# Altium schematic sheet UART EC25 .SchDoc
size A; SheetNumber: 1; SheetTotal: 9
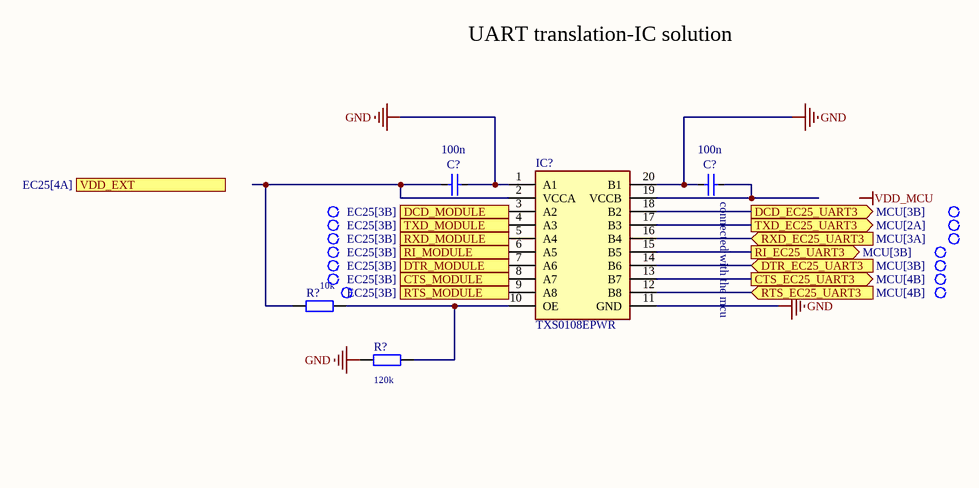
[diagram p0: UART EC25 .SchDoc]

## Parts
(Parts that share a designator on the sheet are numbered #1, #2 ... from top to bottom, then left to right.)
C?#1  value 100n  [CAPC1005X06N]  (hidden comment: C)
C?#2  value 100n  [CAPC1005X06N]  (hidden comment: C)
IC?  TXS0108EPWR  [SOP65P640X120-20N]
R?#1  value 10k  [RESC1005X04N]  (hidden comment: R)
R?#2  value 120k  [RESC1005X04N]  (hidden comment: R)

## Ports
CTS_EC25_UART3 (out, see MCU[4B]), CTS_MODULE (in, see EC25[3B]), DCD_EC25_UART3 (out, see MCU[3B]), DCD_MODULE (in, see EC25[3B]), DTR_EC25_UART3 (in, see MCU[3B]), DTR_MODULE (out, see EC25[3B]), RI_EC25_UART3 (out, see MCU[3B]), RI_MODULE (in, see EC25[3B]), RTS_EC25_UART3 (in, see MCU[4B]), RTS_MODULE (out, see EC25[3B]), RXD_EC25_UART3 (in, see MCU[3A]), RXD_MODULE (out, see EC25[3B]), TXD_EC25_UART3 (out, see MCU[2A]), TXD_MODULE (in, see EC25[3B]), VDD_EXT (in, see EC25[4A])

## Nets
GND: C?#1.2 C?#2.1 IC?.1(A1) IC?.11(GND) IC?.20(B1) R?#2.1
CTS_EC25_UART3: IC?.13(B7) ; port CTS_EC25_UART3
CTS_MODULE: IC?.8(A7) ; port CTS_MODULE
DCD_EC25_UART3: IC?.18(B2) ; port DCD_EC25_UART3
DCD_MODULE: IC?.3(A2) ; port DCD_MODULE
DTR_EC25_UART3: IC?.14(B6) ; port DTR_EC25_UART3
DTR_MODULE: IC?.7(A6) ; port DTR_MODULE
RI_EC25_UART3: IC?.15(B5) ; port RI_EC25_UART3
RI_MODULE: IC?.6(A5) ; port RI_MODULE
RTS_EC25_UART3: IC?.12(B8) ; port RTS_EC25_UART3
RTS_MODULE: IC?.9(A8) ; port RTS_MODULE
RXD_EC25_UART3: IC?.16(B4) ; port RXD_EC25_UART3
RXD_MODULE: IC?.5(A4) ; port RXD_MODULE
TXD_EC25_UART3: IC?.17(B3) ; port TXD_EC25_UART3
TXD_MODULE: IC?.4(A3) ; port TXD_MODULE
NetC?#1_1: C?#1.1 IC?.2(VCCA) R?#1.1
NetC?#2_2: C?#2.2 IC?.19(VCCB)
NetIC?_10: IC?.10(OE) R?#1.2 R?#2.2

## Notes on the sheet
- UART translation-IC solution
- (near C?#2) connected with the mcu
- Labels drawn without touching a wire or pin: VDD_MCU

## Library data of the parts
IC? = TXS0108EPWR: Integrated Circuit; Manufacturer_Name: Texas Instruments; Datasheet Link: http://www.ti.com/lit/ds/symlink/txs0108e.pdf; Height: 1.2mm; Manufacturer_Part_Number: TXS0108EPWR; Mouser Part Number: 595-TXS0108EPWR; Mouser Price/Stock: https://www.mouser.co.uk/ProductDetail/Texas-Instruments/TXS0108EPWR?qs=IUbkBnfnSQLgiWtCbWtYOw%3D%3D; Arrow Part Number: TXS0108EPWR; Arrow Price/Stock: https://www.arrow.com/en/products/txs0108epwr/texas-instruments?utm_currency=USD&region=nac
C?#1 C?#2 = C: MPN: *; Link: *
R?#1 R?#2 = R: MPN: *; Link: *